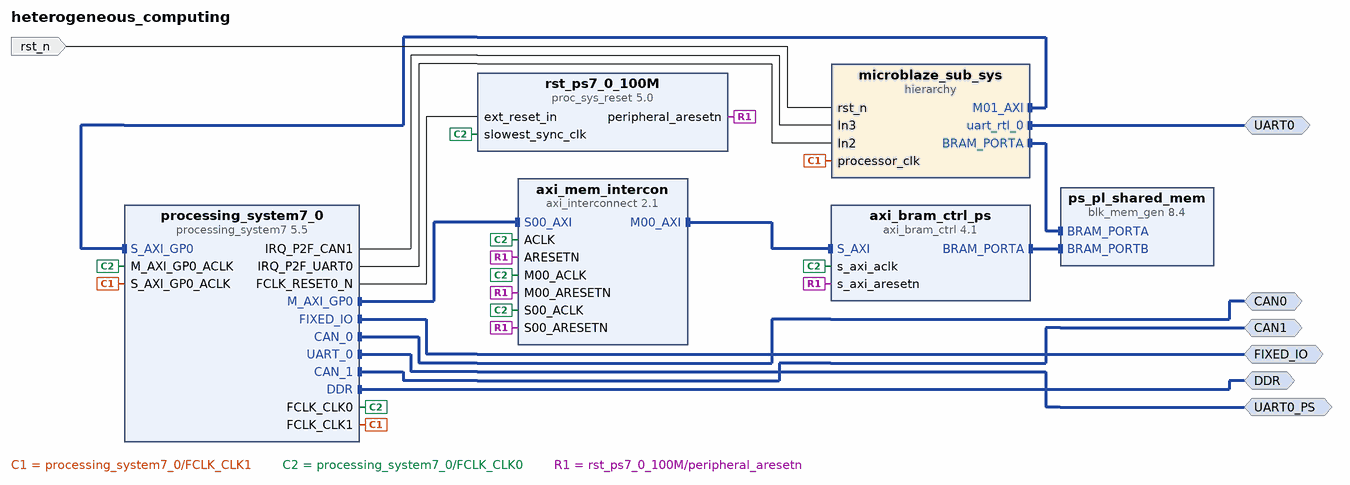
[diagram p0: block diagram of the top level]
# Vivado block design heterogeneous_computing, xc7z020clg484-2, Vivado 2019.1
create_bd_design heterogeneous_computing

create_bd_intf_port -mode Master -vlnv xilinx.com:interface:can_rtl:1.0 CAN0
create_bd_intf_port -mode Master -vlnv xilinx.com:interface:ddrx_rtl:1.0 DDR
create_bd_intf_port -mode Master -vlnv xilinx.com:display_processing_system7:fixedio_rtl:1.0 FIXED_IO
create_bd_intf_port -mode Master -vlnv xilinx.com:interface:can_rtl:1.0 CAN1
create_bd_intf_port -mode Master -vlnv xilinx.com:interface:uart_rtl:1.0 UART0
create_bd_intf_port -mode Master -vlnv xilinx.com:interface:uart_rtl:1.0 UART0_PS
create_bd_port -dir I rst_n

create_bd_cell -type hier microblaze_sub_sys
create_bd_cell -type ip -vlnv xilinx.com:ip:processing_system7:5.5 processing_system7_0
set_property -dict [list \
  CONFIG.PCW_APU_PERIPHERAL_FREQMHZ 666.666666 \
  CONFIG.PCW_CAN0_CAN0_IO EMIO \
  CONFIG.PCW_CAN0_PERIPHERAL_ENABLE 1 \
  CONFIG.PCW_CAN1_CAN1_IO EMIO \
  CONFIG.PCW_CAN1_PERIPHERAL_ENABLE 1 \
  CONFIG.PCW_CPU_CPU_6X4X_MAX_RANGE 767 \
  CONFIG.PCW_ENET0_ENET0_IO {MIO 16 .. 27} \
  CONFIG.PCW_ENET0_GRP_MDIO_ENABLE 1 \
  CONFIG.PCW_ENET0_GRP_MDIO_IO {MIO 52 .. 53} \
  CONFIG.PCW_ENET0_PERIPHERAL_ENABLE 1 \
  CONFIG.PCW_ENET0_RESET_ENABLE 1 \
  CONFIG.PCW_ENET0_RESET_IO {MIO 7} \
  CONFIG.PCW_ENET_RESET_ENABLE 1 \
  CONFIG.PCW_ENET_RESET_SELECT {Share reset pin} \
  CONFIG.PCW_EN_CLK1_PORT 1 \
  CONFIG.PCW_FCLK_CLK0_BUF FALSE \
  CONFIG.PCW_FCLK_CLK1_BUF TRUE \
  CONFIG.PCW_FPGA0_PERIPHERAL_FREQMHZ 100 \
  CONFIG.PCW_FPGA1_PERIPHERAL_FREQMHZ 100 \
  CONFIG.PCW_FPGA2_PERIPHERAL_FREQMHZ 24 \
  CONFIG.PCW_FPGA_FCLK1_ENABLE 1 \
  CONFIG.PCW_GPIO_MIO_GPIO_ENABLE 1 \
  CONFIG.PCW_GPIO_MIO_GPIO_IO MIO \
  CONFIG.PCW_I2C_RESET_ENABLE 1 \
  CONFIG.PCW_P2F_CAN1_INTR 1 \
  CONFIG.PCW_P2F_UART0_INTR 1 \
  CONFIG.PCW_PERIPHERAL_BOARD_PRESET None \
  CONFIG.PCW_PRESET_BANK1_VOLTAGE {LVCMOS 1.8V} \
  CONFIG.PCW_QSPI_PERIPHERAL_ENABLE 0 \
  CONFIG.PCW_SD0_GRP_CD_ENABLE 0 \
  CONFIG.PCW_SD0_GRP_WP_ENABLE 0 \
  CONFIG.PCW_SD0_PERIPHERAL_ENABLE 1 \
  CONFIG.PCW_SD0_SD0_IO {MIO 40 .. 45} \
  CONFIG.PCW_SDIO_PERIPHERAL_FREQMHZ 100 \
  CONFIG.PCW_UART0_PERIPHERAL_ENABLE 1 \
  CONFIG.PCW_UART0_UART0_IO EMIO \
  CONFIG.PCW_UART1_PERIPHERAL_ENABLE 1 \
  CONFIG.PCW_UART1_UART1_IO {MIO 12 .. 13} \
  CONFIG.PCW_UART_PERIPHERAL_FREQMHZ 100 \
  CONFIG.PCW_UIPARAM_DDR_FREQ_MHZ 533.333333 \
  CONFIG.PCW_UIPARAM_DDR_PARTNO {MT41J256M16 RE-125} \
  CONFIG.PCW_USB0_PERIPHERAL_ENABLE 0 \
  CONFIG.PCW_USB_RESET_ENABLE 1 \
  CONFIG.PCW_USE_FABRIC_INTERRUPT 1 \
  CONFIG.PCW_USE_S_AXI_GP0 1 \
] [get_bd_cells processing_system7_0]
# 514 more settings of processing_system7_0 are not shown: defaults, MIO pin electricals, DDR timing, and values the tool derives
create_bd_cell -type ip -vlnv xilinx.com:ip:axi_bram_ctrl:4.1 axi_bram_ctrl_ps
set_property -dict {CONFIG.SINGLE_PORT_BRAM 1} [get_bd_cells axi_bram_ctrl_ps]
create_bd_cell -type ip -vlnv xilinx.com:ip:blk_mem_gen:8.4 ps_pl_shared_mem
set_property -dict [list \
  CONFIG.Enable_B Use_ENB_Pin \
  CONFIG.Memory_Type True_Dual_Port_RAM \
  CONFIG.Port_B_Clock 100 \
  CONFIG.Port_B_Enable_Rate 100 \
  CONFIG.Port_B_Write_Rate 50 \
  CONFIG.Use_RSTB_Pin true \
] [get_bd_cells ps_pl_shared_mem]
create_bd_cell -type ip -vlnv xilinx.com:ip:proc_sys_reset:5.0 rst_ps7_0_100M
create_bd_cell -type ip -vlnv xilinx.com:ip:axi_interconnect:2.1 axi_mem_intercon
set_property -dict {CONFIG.NUM_MI 1} [get_bd_cells axi_mem_intercon]

# ---- hierarchy /microblaze_sub_sys ----
current_bd_instance /microblaze_sub_sys
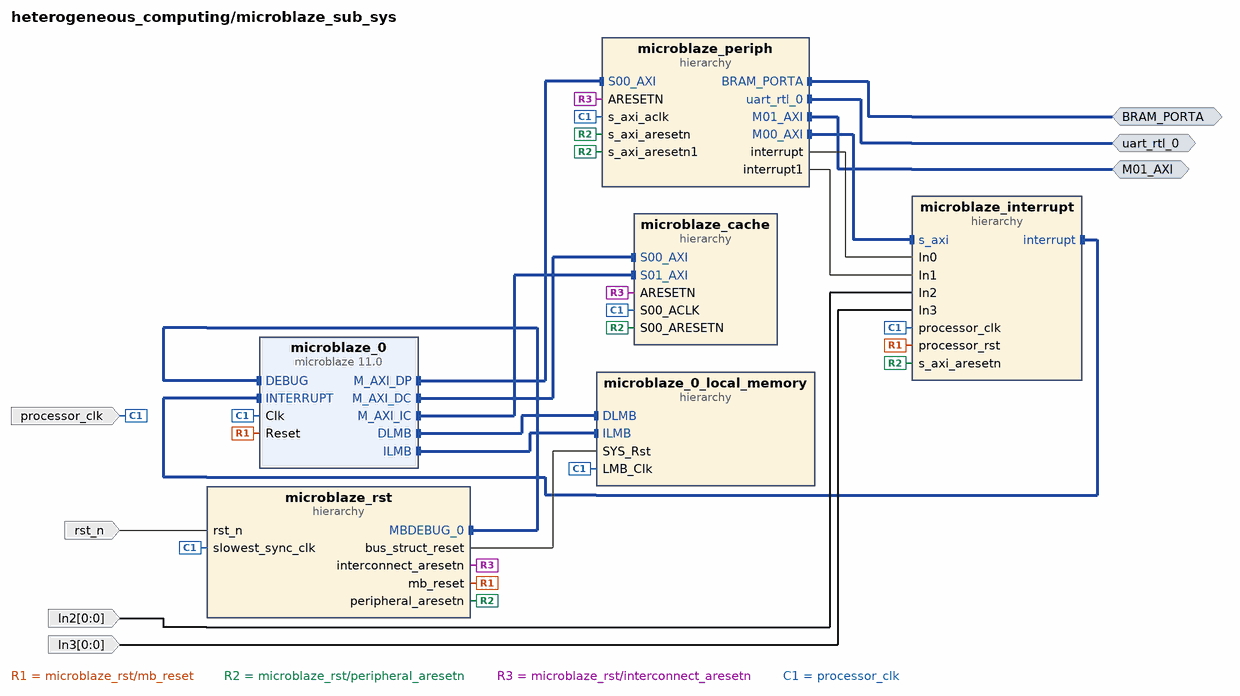
[diagram p1: block diagram inside /microblaze_sub_sys]
create_bd_intf_pin -mode Master -vlnv xilinx.com:interface:bram_rtl:1.0 BRAM_PORTA
create_bd_intf_pin -mode Master -vlnv xilinx.com:interface:aximm_rtl:1.0 M01_AXI
create_bd_intf_pin -mode Master -vlnv xilinx.com:interface:uart_rtl:1.0 uart_rtl_0
create_bd_pin -dir I -type clk processor_clk
create_bd_pin -dir I -type rst rst_n
create_bd_pin -dir I -from 0 -to 0 In2
create_bd_pin -dir I -from 0 -to 0 In3

create_bd_cell -type hier microblaze_interrupt
create_bd_cell -type hier microblaze_rst
create_bd_cell -type hier microblaze_0_local_memory
create_bd_cell -type hier microblaze_cache
create_bd_cell -type hier microblaze_periph
create_bd_cell -type ip -vlnv xilinx.com:ip:microblaze:11.0 microblaze_0
set_property -dict [list \
  CONFIG.C_ADDR_TAG_BITS 1 \
  CONFIG.C_AREA_OPTIMIZED 0 \
  CONFIG.C_CACHE_BYTE_SIZE 8192 \
  CONFIG.C_DCACHE_ADDR_TAG 1 \
  CONFIG.C_DCACHE_BYTE_SIZE 8192 \
  CONFIG.C_DCACHE_USE_WRITEBACK 1 \
  CONFIG.C_DEBUG_ENABLED 1 \
  CONFIG.C_DIV_ZERO_EXCEPTION 1 \
  CONFIG.C_D_AXI 1 \
  CONFIG.C_D_LMB 1 \
  CONFIG.C_ILL_OPCODE_EXCEPTION 1 \
  CONFIG.C_I_LMB 1 \
  CONFIG.C_M_AXI_D_BUS_EXCEPTION 1 \
  CONFIG.C_M_AXI_I_BUS_EXCEPTION 1 \
  CONFIG.C_NUMBER_OF_PC_BRK 2 \
  CONFIG.C_OPCODE_0x0_ILLEGAL 1 \
  CONFIG.C_UNALIGNED_EXCEPTIONS 1 \
  CONFIG.C_USE_BARREL 1 \
  CONFIG.C_USE_DCACHE 1 \
  CONFIG.C_USE_DIV 1 \
  CONFIG.C_USE_HW_MUL 1 \
  CONFIG.C_USE_ICACHE 1 \
  CONFIG.C_USE_MSR_INSTR 1 \
  CONFIG.C_USE_PCMP_INSTR 1 \
  CONFIG.C_USE_REORDER_INSTR 1 \
  CONFIG.G_TEMPLATE_LIST 9 \
  CONFIG.G_USE_EXCEPTIONS 1 \
] [get_bd_cells microblaze_0]

# ---- hierarchy /microblaze_sub_sys/microblaze_interrupt ----
current_bd_instance /microblaze_sub_sys/microblaze_interrupt
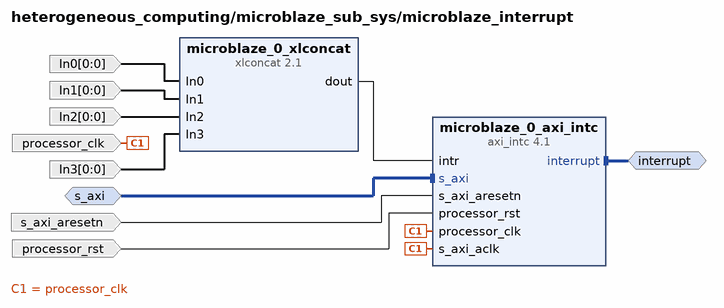
[diagram p2: block diagram inside /microblaze_sub_sys/microblaze_interrupt]
create_bd_intf_pin -mode Slave -vlnv xilinx.com:interface:aximm_rtl:1.0 s_axi
create_bd_intf_pin -mode Master -vlnv xilinx.com:interface:mbinterrupt_rtl:1.0 interrupt
create_bd_pin -dir I -type clk processor_clk
create_bd_pin -dir I -type rst s_axi_aresetn
create_bd_pin -dir I -type rst processor_rst
create_bd_pin -dir I -from 0 -to 0 In0
create_bd_pin -dir I -from 0 -to 0 In1
create_bd_pin -dir I -from 0 -to 0 In2
create_bd_pin -dir I -from 0 -to 0 In3

create_bd_cell -type ip -vlnv xilinx.com:ip:axi_intc:4.1 microblaze_0_axi_intc
set_property -dict {CONFIG.C_HAS_FAST 1 CONFIG.C_IRQ_IS_LEVEL 0} [get_bd_cells microblaze_0_axi_intc]
create_bd_cell -type ip -vlnv xilinx.com:ip:xlconcat:2.1 microblaze_0_xlconcat
set_property -dict {CONFIG.NUM_PORTS 4 CONFIG.dout_width 4} [get_bd_cells microblaze_0_xlconcat]

# ---- hierarchy /microblaze_sub_sys/microblaze_rst ----
current_bd_instance /microblaze_sub_sys/microblaze_rst
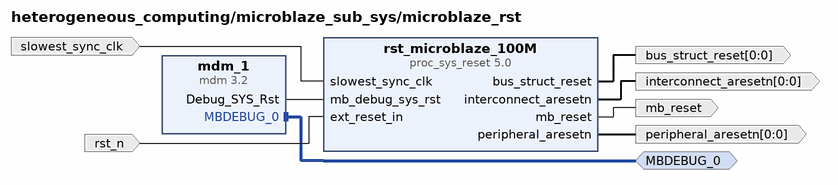
[diagram p3: block diagram inside /microblaze_sub_sys/microblaze_rst]
create_bd_intf_pin -mode Master -vlnv xilinx.com:interface:mbdebug_rtl:3.0 MBDEBUG_0
create_bd_pin -dir I -type clk slowest_sync_clk
create_bd_pin -dir I -type rst rst_n
create_bd_pin -dir O -type rst mb_reset
create_bd_pin -dir O -from 0 -to 0 -type rst bus_struct_reset
create_bd_pin -dir O -from 0 -to 0 -type rst interconnect_aresetn
create_bd_pin -dir O -from 0 -to 0 -type rst peripheral_aresetn

create_bd_cell -type ip -vlnv xilinx.com:ip:mdm:3.2 mdm_1
create_bd_cell -type ip -vlnv xilinx.com:ip:proc_sys_reset:5.0 rst_microblaze_100M

# ---- hierarchy /microblaze_sub_sys/microblaze_0_local_memory ----
current_bd_instance /microblaze_sub_sys/microblaze_0_local_memory
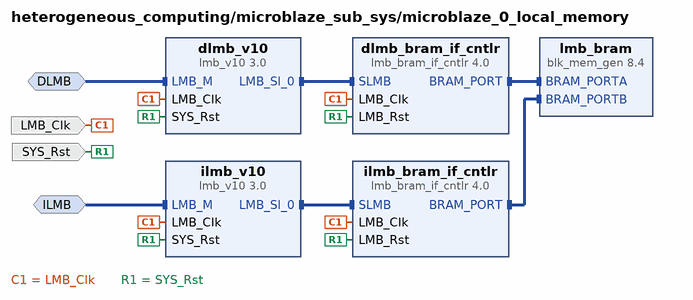
[diagram p4: block diagram inside /microblaze_sub_sys/microblaze_0_local_memory]
create_bd_intf_pin -mode MirroredMaster -vlnv xilinx.com:interface:lmb_rtl:1.0 DLMB
create_bd_intf_pin -mode MirroredMaster -vlnv xilinx.com:interface:lmb_rtl:1.0 ILMB
create_bd_pin -dir I -type clk LMB_Clk
create_bd_pin -dir I -type rst SYS_Rst

create_bd_cell -type ip -vlnv xilinx.com:ip:lmb_v10:3.0 dlmb_v10
create_bd_cell -type ip -vlnv xilinx.com:ip:lmb_v10:3.0 ilmb_v10
create_bd_cell -type ip -vlnv xilinx.com:ip:lmb_bram_if_cntlr:4.0 dlmb_bram_if_cntlr
set_property -dict {CONFIG.C_ECC 0} [get_bd_cells dlmb_bram_if_cntlr]
create_bd_cell -type ip -vlnv xilinx.com:ip:lmb_bram_if_cntlr:4.0 ilmb_bram_if_cntlr
set_property -dict {CONFIG.C_ECC 0} [get_bd_cells ilmb_bram_if_cntlr]
create_bd_cell -type ip -vlnv xilinx.com:ip:blk_mem_gen:8.4 lmb_bram
set_property -dict [list \
  CONFIG.Enable_B Use_ENB_Pin \
  CONFIG.Memory_Type True_Dual_Port_RAM \
  CONFIG.Port_B_Clock 100 \
  CONFIG.Port_B_Enable_Rate 100 \
  CONFIG.Port_B_Write_Rate 50 \
  CONFIG.Use_RSTB_Pin true \
  CONFIG.use_bram_block BRAM_Controller \
] [get_bd_cells lmb_bram]

# ---- hierarchy /microblaze_sub_sys/microblaze_cache ----
current_bd_instance /microblaze_sub_sys/microblaze_cache
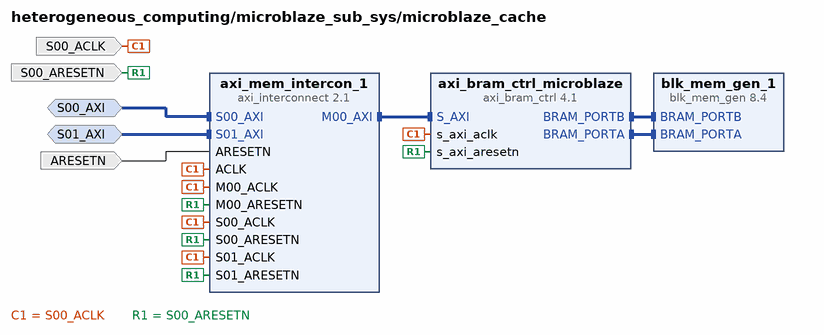
[diagram p5: block diagram inside /microblaze_sub_sys/microblaze_cache]
create_bd_intf_pin -mode Slave -vlnv xilinx.com:interface:aximm_rtl:1.0 S00_AXI
create_bd_intf_pin -mode Slave -vlnv xilinx.com:interface:aximm_rtl:1.0 S01_AXI
create_bd_pin -dir I -type clk S00_ACLK
create_bd_pin -dir I -type rst S00_ARESETN
create_bd_pin -dir I -type rst ARESETN

create_bd_cell -type ip -vlnv xilinx.com:ip:axi_bram_ctrl:4.1 axi_bram_ctrl_microblaze
set_property -dict {CONFIG.SINGLE_PORT_BRAM 0} [get_bd_cells axi_bram_ctrl_microblaze]
create_bd_cell -type ip -vlnv xilinx.com:ip:axi_interconnect:2.1 axi_mem_intercon_1
set_property -dict {CONFIG.NUM_MI 1 CONFIG.NUM_SI 2} [get_bd_cells axi_mem_intercon_1]
create_bd_cell -type ip -vlnv xilinx.com:ip:blk_mem_gen:8.4 blk_mem_gen_1
set_property -dict [list \
  CONFIG.Enable_B Use_ENB_Pin \
  CONFIG.Memory_Type True_Dual_Port_RAM \
  CONFIG.Port_B_Clock 100 \
  CONFIG.Port_B_Enable_Rate 100 \
  CONFIG.Port_B_Write_Rate 50 \
  CONFIG.Use_RSTB_Pin true \
] [get_bd_cells blk_mem_gen_1]

# ---- hierarchy /microblaze_sub_sys/microblaze_periph ----
current_bd_instance /microblaze_sub_sys/microblaze_periph
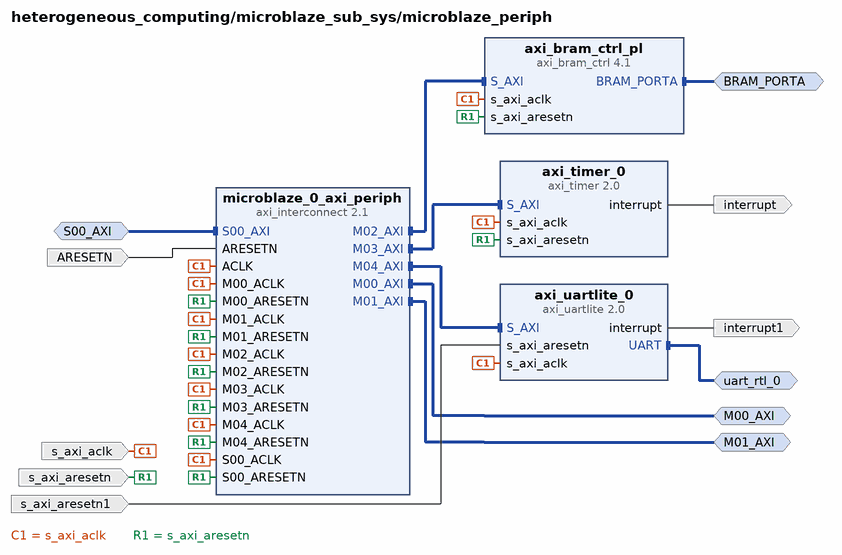
[diagram p6: block diagram inside /microblaze_sub_sys/microblaze_periph]
create_bd_intf_pin -mode Master -vlnv xilinx.com:interface:bram_rtl:1.0 BRAM_PORTA
create_bd_intf_pin -mode Slave -vlnv xilinx.com:interface:aximm_rtl:1.0 S00_AXI
create_bd_intf_pin -mode Master -vlnv xilinx.com:interface:aximm_rtl:1.0 M00_AXI
create_bd_intf_pin -mode Master -vlnv xilinx.com:interface:aximm_rtl:1.0 M01_AXI
create_bd_intf_pin -mode Master -vlnv xilinx.com:interface:uart_rtl:1.0 uart_rtl_0
create_bd_pin -dir O -type intr interrupt
create_bd_pin -dir I -type clk s_axi_aclk
create_bd_pin -dir I -type rst s_axi_aresetn
create_bd_pin -dir I -type rst ARESETN
create_bd_pin -dir I -type rst s_axi_aresetn1
create_bd_pin -dir O -type intr interrupt1

create_bd_cell -type ip -vlnv xilinx.com:ip:axi_bram_ctrl:4.1 axi_bram_ctrl_pl
set_property -dict {CONFIG.SINGLE_PORT_BRAM 1} [get_bd_cells axi_bram_ctrl_pl]
create_bd_cell -type ip -vlnv xilinx.com:ip:axi_timer:2.0 axi_timer_0
set_property -dict {CONFIG.enable_timer2 0} [get_bd_cells axi_timer_0]
create_bd_cell -type ip -vlnv xilinx.com:ip:axi_uartlite:2.0 axi_uartlite_0
set_property -dict {CONFIG.C_BAUDRATE 115200} [get_bd_cells axi_uartlite_0]
create_bd_cell -type ip -vlnv xilinx.com:ip:axi_interconnect:2.1 microblaze_0_axi_periph
set_property -dict {CONFIG.NUM_MI 5} [get_bd_cells microblaze_0_axi_periph]

# ---- connections ----

current_bd_instance /microblaze_sub_sys
connect_bd_intf_net [get_bd_intf_pins uart_rtl_0] [get_bd_intf_pins microblaze_periph/uart_rtl_0]
connect_bd_intf_net [get_bd_intf_pins microblaze_rst/MBDEBUG_0] [get_bd_intf_pins microblaze_0/DEBUG]
connect_bd_intf_net [get_bd_intf_pins microblaze_0/M_AXI_DC] [get_bd_intf_pins microblaze_cache/S00_AXI]
connect_bd_intf_net [get_bd_intf_pins microblaze_0/DLMB] [get_bd_intf_pins microblaze_0_local_memory/DLMB]
connect_bd_intf_net [get_bd_intf_pins microblaze_0/M_AXI_IC] [get_bd_intf_pins microblaze_cache/S01_AXI]
connect_bd_intf_net [get_bd_intf_pins microblaze_interrupt/interrupt] [get_bd_intf_pins microblaze_0/INTERRUPT]
connect_bd_intf_net -intf_net microblaze_0_axi_dp [get_bd_intf_pins microblaze_periph/S00_AXI] [get_bd_intf_pins microblaze_0/M_AXI_DP]
connect_bd_intf_net [get_bd_intf_pins BRAM_PORTA] [get_bd_intf_pins microblaze_periph/BRAM_PORTA]
connect_bd_intf_net -intf_net microblaze_0_intc_axi [get_bd_intf_pins microblaze_periph/M00_AXI] [get_bd_intf_pins microblaze_interrupt/s_axi]
connect_bd_intf_net [get_bd_intf_pins M01_AXI] [get_bd_intf_pins microblaze_periph/M01_AXI]
connect_bd_intf_net [get_bd_intf_pins microblaze_0/ILMB] [get_bd_intf_pins microblaze_0_local_memory/ILMB]
connect_bd_net -net rst_ps7_0_100M_1_mb_reset [get_bd_pins microblaze_rst/mb_reset] \
  [get_bd_pins microblaze_interrupt/processor_rst] [get_bd_pins microblaze_0/Reset]
connect_bd_net -net rst_ps7_0_100M_1_peripheral_aresetn [get_bd_pins microblaze_rst/peripheral_aresetn] \
  [get_bd_pins microblaze_cache/S00_ARESETN] [get_bd_pins microblaze_periph/s_axi_aresetn] \
  [get_bd_pins microblaze_interrupt/s_axi_aresetn] [get_bd_pins microblaze_periph/s_axi_aresetn1]
connect_bd_net -net rst_ps7_0_100M_1_bus_struct_reset [get_bd_pins microblaze_rst/bus_struct_reset] [get_bd_pins microblaze_0_local_memory/SYS_Rst]
connect_bd_net -net rst_ps7_0_100M_1_interconnect_aresetn [get_bd_pins microblaze_rst/interconnect_aresetn] \
  [get_bd_pins microblaze_cache/ARESETN] [get_bd_pins microblaze_periph/ARESETN]
connect_bd_net -net microblaze_0_Clk [get_bd_pins processor_clk] \
  [get_bd_pins microblaze_interrupt/processor_clk] [get_bd_pins microblaze_periph/s_axi_aclk] \
  [get_bd_pins microblaze_cache/S00_ACLK] [get_bd_pins microblaze_0_local_memory/LMB_Clk] \
  [get_bd_pins microblaze_rst/slowest_sync_clk] [get_bd_pins microblaze_0/Clk]
connect_bd_net [get_bd_pins rst_n] [get_bd_pins microblaze_rst/rst_n]
connect_bd_net [get_bd_pins microblaze_periph/interrupt] [get_bd_pins microblaze_interrupt/In0]
connect_bd_net [get_bd_pins microblaze_periph/interrupt1] [get_bd_pins microblaze_interrupt/In1]
connect_bd_net -net In2_1 [get_bd_pins In2] [get_bd_pins microblaze_interrupt/In2]
connect_bd_net -net In3_1 [get_bd_pins In3] [get_bd_pins microblaze_interrupt/In3]
set_property HDL_ATTRIBUTE.BMM_INFO_PROCESSOR {microblaze-le > heterogeneous_computing microblaze_sub_sys/microblaze_0_local_memory/dlmb_bram_if_cntlr heterogeneous_computing microblaze_sub_sys/microblaze_periph/axi_bram_ctrl_pl heterogeneous_computing microblaze_sub_sys/microblaze_cache/axi_bram_ctrl_microblaze} [get_bd_cells microblaze_0]
set_property HDL_ATTRIBUTE.KEEP_HIERARCHY yes [get_bd_cells microblaze_0]

current_bd_instance /microblaze_sub_sys/microblaze_interrupt
connect_bd_intf_net -intf_net microblaze_0_intc_axi [get_bd_intf_pins s_axi] [get_bd_intf_pins microblaze_0_axi_intc/s_axi]
connect_bd_intf_net -intf_net microblaze_0_interrupt [get_bd_intf_pins interrupt] [get_bd_intf_pins microblaze_0_axi_intc/interrupt]
connect_bd_net -net microblaze_0_intr [get_bd_pins microblaze_0_xlconcat/dout] [get_bd_pins microblaze_0_axi_intc/intr]
connect_bd_net -net microblaze_0_Clk [get_bd_pins processor_clk] \
  [get_bd_pins microblaze_0_axi_intc/s_axi_aclk] [get_bd_pins microblaze_0_axi_intc/processor_clk]
connect_bd_net -net rst_ps7_0_100M_1_peripheral_aresetn [get_bd_pins s_axi_aresetn] [get_bd_pins microblaze_0_axi_intc/s_axi_aresetn]
connect_bd_net -net rst_ps7_0_100M_1_mb_reset [get_bd_pins processor_rst] [get_bd_pins microblaze_0_axi_intc/processor_rst]
connect_bd_net -net processing_system7_0_IRQ_P2F_CAN0 [get_bd_pins In0] [get_bd_pins microblaze_0_xlconcat/In0]
connect_bd_net -net axi_timer_0_interrupt [get_bd_pins In1] [get_bd_pins microblaze_0_xlconcat/In1]
connect_bd_net -net In2_1 [get_bd_pins In2] [get_bd_pins microblaze_0_xlconcat/In2]
connect_bd_net -net In3_1 [get_bd_pins In3] [get_bd_pins microblaze_0_xlconcat/In3]

current_bd_instance /microblaze_sub_sys/microblaze_rst
connect_bd_intf_net -intf_net microblaze_0_debug [get_bd_intf_pins MBDEBUG_0] [get_bd_intf_pins mdm_1/MBDEBUG_0]
connect_bd_net [get_bd_pins mdm_1/Debug_SYS_Rst] [get_bd_pins rst_microblaze_100M/mb_debug_sys_rst]
connect_bd_net -net microblaze_0_Clk [get_bd_pins slowest_sync_clk] [get_bd_pins rst_microblaze_100M/slowest_sync_clk]
connect_bd_net [get_bd_pins rst_n] [get_bd_pins rst_microblaze_100M/ext_reset_in]
connect_bd_net -net rst_ps7_0_100M_1_mb_reset [get_bd_pins rst_microblaze_100M/mb_reset] [get_bd_pins mb_reset]
connect_bd_net -net rst_ps7_0_100M_1_bus_struct_reset [get_bd_pins rst_microblaze_100M/bus_struct_reset] [get_bd_pins bus_struct_reset]
connect_bd_net -net rst_ps7_0_100M_1_interconnect_aresetn [get_bd_pins rst_microblaze_100M/interconnect_aresetn] [get_bd_pins interconnect_aresetn]
connect_bd_net -net rst_ps7_0_100M_1_peripheral_aresetn [get_bd_pins rst_microblaze_100M/peripheral_aresetn] [get_bd_pins peripheral_aresetn]

current_bd_instance /microblaze_sub_sys/microblaze_0_local_memory
connect_bd_intf_net -intf_net microblaze_0_dlmb_bus [get_bd_intf_pins dlmb_v10/LMB_Sl_0] [get_bd_intf_pins dlmb_bram_if_cntlr/SLMB]
connect_bd_intf_net -intf_net microblaze_0_dlmb [get_bd_intf_pins DLMB] [get_bd_intf_pins dlmb_v10/LMB_M]
connect_bd_intf_net -intf_net microblaze_0_ilmb_bus [get_bd_intf_pins ilmb_v10/LMB_Sl_0] [get_bd_intf_pins ilmb_bram_if_cntlr/SLMB]
connect_bd_intf_net -intf_net microblaze_0_dlmb_cntlr [get_bd_intf_pins dlmb_bram_if_cntlr/BRAM_PORT] [get_bd_intf_pins lmb_bram/BRAM_PORTA]
connect_bd_intf_net -intf_net microblaze_0_ilmb_cntlr [get_bd_intf_pins ilmb_bram_if_cntlr/BRAM_PORT] [get_bd_intf_pins lmb_bram/BRAM_PORTB]
connect_bd_intf_net -intf_net microblaze_0_ilmb [get_bd_intf_pins ILMB] [get_bd_intf_pins ilmb_v10/LMB_M]
connect_bd_net -net microblaze_0_Clk [get_bd_pins LMB_Clk] \
  [get_bd_pins dlmb_v10/LMB_Clk] [get_bd_pins ilmb_v10/LMB_Clk] [get_bd_pins dlmb_bram_if_cntlr/LMB_Clk] \
  [get_bd_pins ilmb_bram_if_cntlr/LMB_Clk]
connect_bd_net [get_bd_pins SYS_Rst] \
  [get_bd_pins dlmb_v10/SYS_Rst] [get_bd_pins ilmb_v10/SYS_Rst] [get_bd_pins dlmb_bram_if_cntlr/LMB_Rst] \
  [get_bd_pins ilmb_bram_if_cntlr/LMB_Rst]
set_property HDL_ATTRIBUTE.BMM_INFO_ADDRESS_SPACE {byte  0x00000000 32 > heterogeneous_computing microblaze_sub_sys/microblaze_0_local_memory/lmb_bram} [get_bd_cells dlmb_bram_if_cntlr]
set_property HDL_ATTRIBUTE.KEEP_HIERARCHY yes [get_bd_cells dlmb_bram_if_cntlr]

current_bd_instance /microblaze_sub_sys/microblaze_cache
connect_bd_intf_net -intf_net microblaze_0_M_AXI_DC [get_bd_intf_pins S00_AXI] [get_bd_intf_pins axi_mem_intercon_1/S00_AXI]
connect_bd_intf_net -intf_net microblaze_0_M_AXI_IC [get_bd_intf_pins S01_AXI] [get_bd_intf_pins axi_mem_intercon_1/S01_AXI]
connect_bd_intf_net [get_bd_intf_pins axi_mem_intercon_1/M00_AXI] [get_bd_intf_pins axi_bram_ctrl_microblaze/S_AXI]
connect_bd_intf_net -intf_net axi_bram_ctrl_2_BRAM_PORTB [get_bd_intf_pins axi_bram_ctrl_microblaze/BRAM_PORTB] [get_bd_intf_pins blk_mem_gen_1/BRAM_PORTB]
connect_bd_intf_net -intf_net axi_bram_ctrl_2_BRAM_PORTA [get_bd_intf_pins axi_bram_ctrl_microblaze/BRAM_PORTA] [get_bd_intf_pins blk_mem_gen_1/BRAM_PORTA]
connect_bd_net -net microblaze_0_Clk [get_bd_pins S00_ACLK] \
  [get_bd_pins axi_bram_ctrl_microblaze/s_axi_aclk] [get_bd_pins axi_mem_intercon_1/ACLK] \
  [get_bd_pins axi_mem_intercon_1/S00_ACLK] [get_bd_pins axi_mem_intercon_1/M00_ACLK] \
  [get_bd_pins axi_mem_intercon_1/S01_ACLK]
connect_bd_net -net rst_ps7_0_100M_1_peripheral_aresetn [get_bd_pins S00_ARESETN] \
  [get_bd_pins axi_bram_ctrl_microblaze/s_axi_aresetn] [get_bd_pins axi_mem_intercon_1/S00_ARESETN] \
  [get_bd_pins axi_mem_intercon_1/M00_ARESETN] [get_bd_pins axi_mem_intercon_1/S01_ARESETN]
connect_bd_net -net rst_ps7_0_100M_1_interconnect_aresetn [get_bd_pins ARESETN] [get_bd_pins axi_mem_intercon_1/ARESETN]
set_property HDL_ATTRIBUTE.BMM_INFO_ADDRESS_SPACE {byte  0xC2000000 32 > heterogeneous_computing microblaze_sub_sys/microblaze_cache/blk_mem_gen_1} [get_bd_cells axi_bram_ctrl_microblaze]
set_property HDL_ATTRIBUTE.KEEP_HIERARCHY yes [get_bd_cells axi_bram_ctrl_microblaze]

current_bd_instance /microblaze_sub_sys/microblaze_periph
connect_bd_intf_net [get_bd_intf_pins microblaze_0_axi_periph/M02_AXI] [get_bd_intf_pins axi_bram_ctrl_pl/S_AXI]
connect_bd_intf_net [get_bd_intf_pins BRAM_PORTA] [get_bd_intf_pins axi_bram_ctrl_pl/BRAM_PORTA]
connect_bd_intf_net [get_bd_intf_pins microblaze_0_axi_periph/M03_AXI] [get_bd_intf_pins axi_timer_0/S_AXI]
connect_bd_intf_net [get_bd_intf_pins uart_rtl_0] [get_bd_intf_pins axi_uartlite_0/UART]
connect_bd_intf_net -intf_net microblaze_0_axi_dp [get_bd_intf_pins S00_AXI] [get_bd_intf_pins microblaze_0_axi_periph/S00_AXI]
connect_bd_intf_net [get_bd_intf_pins M01_AXI] [get_bd_intf_pins microblaze_0_axi_periph/M01_AXI]
connect_bd_intf_net -intf_net microblaze_0_intc_axi [get_bd_intf_pins M00_AXI] [get_bd_intf_pins microblaze_0_axi_periph/M00_AXI]
connect_bd_intf_net [get_bd_intf_pins microblaze_0_axi_periph/M04_AXI] [get_bd_intf_pins axi_uartlite_0/S_AXI]
connect_bd_net [get_bd_pins axi_timer_0/interrupt] [get_bd_pins interrupt]
connect_bd_net -net microblaze_0_Clk [get_bd_pins s_axi_aclk] \
  [get_bd_pins axi_bram_ctrl_pl/s_axi_aclk] [get_bd_pins axi_timer_0/s_axi_aclk] [get_bd_pins axi_uartlite_0/s_axi_aclk] \
  [get_bd_pins microblaze_0_axi_periph/ACLK] [get_bd_pins microblaze_0_axi_periph/S00_ACLK] \
  [get_bd_pins microblaze_0_axi_periph/M00_ACLK] [get_bd_pins microblaze_0_axi_periph/M01_ACLK] \
  [get_bd_pins microblaze_0_axi_periph/M02_ACLK] [get_bd_pins microblaze_0_axi_periph/M03_ACLK] \
  [get_bd_pins microblaze_0_axi_periph/M04_ACLK]
connect_bd_net -net rst_ps7_0_100M_1_peripheral_aresetn [get_bd_pins s_axi_aresetn] \
  [get_bd_pins axi_bram_ctrl_pl/s_axi_aresetn] [get_bd_pins axi_timer_0/s_axi_aresetn] \
  [get_bd_pins microblaze_0_axi_periph/S00_ARESETN] [get_bd_pins microblaze_0_axi_periph/M00_ARESETN] \
  [get_bd_pins microblaze_0_axi_periph/M01_ARESETN] [get_bd_pins microblaze_0_axi_periph/M02_ARESETN] \
  [get_bd_pins microblaze_0_axi_periph/M03_ARESETN] [get_bd_pins microblaze_0_axi_periph/M04_ARESETN]
connect_bd_net -net rst_ps7_0_100M_1_interconnect_aresetn [get_bd_pins ARESETN] [get_bd_pins microblaze_0_axi_periph/ARESETN]
connect_bd_net -net s_axi_aresetn1_1 [get_bd_pins s_axi_aresetn1] [get_bd_pins axi_uartlite_0/s_axi_aresetn]
connect_bd_net [get_bd_pins axi_uartlite_0/interrupt] [get_bd_pins interrupt1]
set_property HDL_ATTRIBUTE.BMM_INFO_ADDRESS_SPACE {byte  0xC0000000 32 > heterogeneous_computing ps_pl_shared_mem} [get_bd_cells axi_bram_ctrl_pl]
set_property HDL_ATTRIBUTE.KEEP_HIERARCHY yes [get_bd_cells axi_bram_ctrl_pl]

current_bd_instance /
connect_bd_intf_net [get_bd_intf_pins axi_mem_intercon/M00_AXI] [get_bd_intf_pins axi_bram_ctrl_ps/S_AXI]
connect_bd_intf_net [get_bd_intf_pins processing_system7_0/M_AXI_GP0] [get_bd_intf_pins axi_mem_intercon/S00_AXI]
connect_bd_intf_net [get_bd_intf_pins axi_bram_ctrl_ps/BRAM_PORTA] [get_bd_intf_pins ps_pl_shared_mem/BRAM_PORTB]
connect_bd_intf_net [get_bd_intf_ports FIXED_IO] [get_bd_intf_pins processing_system7_0/FIXED_IO]
connect_bd_intf_net [get_bd_intf_pins microblaze_sub_sys/M01_AXI] [get_bd_intf_pins processing_system7_0/S_AXI_GP0]
connect_bd_intf_net [get_bd_intf_ports UART0_PS] [get_bd_intf_pins processing_system7_0/UART_0]
connect_bd_intf_net [get_bd_intf_ports CAN0] [get_bd_intf_pins processing_system7_0/CAN_0]
connect_bd_intf_net [get_bd_intf_ports UART0] [get_bd_intf_pins microblaze_sub_sys/uart_rtl_0]
connect_bd_intf_net [get_bd_intf_ports CAN1] [get_bd_intf_pins processing_system7_0/CAN_1]
connect_bd_intf_net [get_bd_intf_ports DDR] [get_bd_intf_pins processing_system7_0/DDR]
connect_bd_intf_net [get_bd_intf_pins ps_pl_shared_mem/BRAM_PORTA] [get_bd_intf_pins microblaze_sub_sys/BRAM_PORTA]
connect_bd_net -net microblaze_0_Clk [get_bd_pins processing_system7_0/FCLK_CLK1] \
  [get_bd_pins processing_system7_0/S_AXI_GP0_ACLK] [get_bd_pins microblaze_sub_sys/processor_clk]
connect_bd_net [get_bd_ports rst_n] [get_bd_pins microblaze_sub_sys/rst_n]
connect_bd_net [get_bd_pins processing_system7_0/FCLK_CLK0] \
  [get_bd_pins processing_system7_0/M_AXI_GP0_ACLK] [get_bd_pins axi_bram_ctrl_ps/s_axi_aclk] \
  [get_bd_pins rst_ps7_0_100M/slowest_sync_clk] [get_bd_pins axi_mem_intercon/ACLK] [get_bd_pins axi_mem_intercon/S00_ACLK] \
  [get_bd_pins axi_mem_intercon/M00_ACLK]
connect_bd_net [get_bd_pins processing_system7_0/FCLK_RESET0_N] [get_bd_pins rst_ps7_0_100M/ext_reset_in]
connect_bd_net [get_bd_pins rst_ps7_0_100M/peripheral_aresetn] \
  [get_bd_pins axi_bram_ctrl_ps/s_axi_aresetn] [get_bd_pins axi_mem_intercon/S00_ARESETN] \
  [get_bd_pins axi_mem_intercon/M00_ARESETN] [get_bd_pins axi_mem_intercon/ARESETN]
connect_bd_net [get_bd_pins processing_system7_0/IRQ_P2F_CAN1] [get_bd_pins microblaze_sub_sys/In3]
connect_bd_net [get_bd_pins processing_system7_0/IRQ_P2F_UART0] [get_bd_pins microblaze_sub_sys/In2]
set_property HDL_ATTRIBUTE.BMM_INFO_PROCESSOR {arm > heterogeneous_computing axi_bram_ctrl_ps} [get_bd_cells processing_system7_0]
set_property HDL_ATTRIBUTE.KEEP_HIERARCHY yes [get_bd_cells processing_system7_0]
set_property HDL_ATTRIBUTE.BMM_INFO_ADDRESS_SPACE {byte  0x40000000 32 > heterogeneous_computing ps_pl_shared_mem} [get_bd_cells axi_bram_ctrl_ps]
set_property HDL_ATTRIBUTE.KEEP_HIERARCHY yes [get_bd_cells axi_bram_ctrl_ps]

# ---- address map ----
assign_bd_address -offset 0x00000000 -range 128K -target_address_space [get_bd_addr_spaces microblaze_sub_sys/microblaze_0/Data] [get_bd_addr_segs microblaze_sub_sys/microblaze_0_local_memory/dlmb_bram_if_cntlr/SLMB/Mem]
assign_bd_address -offset 0x20000000 -range 512M -target_address_space [get_bd_addr_spaces microblaze_sub_sys/microblaze_0/Data] [get_bd_addr_segs processing_system7_0/S_AXI_GP0/GP0_DDR_LOWOCM]
assign_bd_address -offset 0x40000000 -range 16M -target_address_space [get_bd_addr_spaces microblaze_sub_sys/microblaze_0/Data] [get_bd_addr_segs processing_system7_0/S_AXI_GP0/GP0_M_AXI_GP0]
assign_bd_address -offset 0x41000000 -range 64K -target_address_space [get_bd_addr_spaces microblaze_sub_sys/microblaze_0/Data] [get_bd_addr_segs microblaze_sub_sys/microblaze_periph/axi_uartlite_0/S_AXI/Reg]
assign_bd_address -offset 0x41200000 -range 64K -target_address_space [get_bd_addr_spaces microblaze_sub_sys/microblaze_0/Data] [get_bd_addr_segs microblaze_sub_sys/microblaze_interrupt/microblaze_0_axi_intc/S_AXI/Reg]
assign_bd_address -offset 0x41C00000 -range 64K -target_address_space [get_bd_addr_spaces microblaze_sub_sys/microblaze_0/Data] [get_bd_addr_segs microblaze_sub_sys/microblaze_periph/axi_timer_0/S_AXI/Reg]
assign_bd_address -offset 0xC0000000 -range 32K -target_address_space [get_bd_addr_spaces microblaze_sub_sys/microblaze_0/Data] [get_bd_addr_segs microblaze_sub_sys/microblaze_periph/axi_bram_ctrl_pl/S_AXI/Mem0]
assign_bd_address -offset 0xC2000000 -range 8K -target_address_space [get_bd_addr_spaces microblaze_sub_sys/microblaze_0/Data] [get_bd_addr_segs microblaze_sub_sys/microblaze_cache/axi_bram_ctrl_microblaze/S_AXI/Mem0]
assign_bd_address -offset 0xE0000000 -range 4M -target_address_space [get_bd_addr_spaces microblaze_sub_sys/microblaze_0/Data] [get_bd_addr_segs processing_system7_0/S_AXI_GP0/GP0_IOP]
assign_bd_address -offset 0x00000000 -range 128K -target_address_space [get_bd_addr_spaces microblaze_sub_sys/microblaze_0/Instruction] [get_bd_addr_segs microblaze_sub_sys/microblaze_0_local_memory/ilmb_bram_if_cntlr/SLMB/Mem]
assign_bd_address -offset 0xC2000000 -range 8K -target_address_space [get_bd_addr_spaces microblaze_sub_sys/microblaze_0/Instruction] [get_bd_addr_segs microblaze_sub_sys/microblaze_cache/axi_bram_ctrl_microblaze/S_AXI/Mem0]
assign_bd_address -offset 0x40000000 -range 32K -target_address_space [get_bd_addr_spaces processing_system7_0/Data] [get_bd_addr_segs axi_bram_ctrl_ps/S_AXI/Mem0]

validate_bd_design
save_bd_design
